# EAGLE design 7seg-weather (EAGLE 7.4.0)
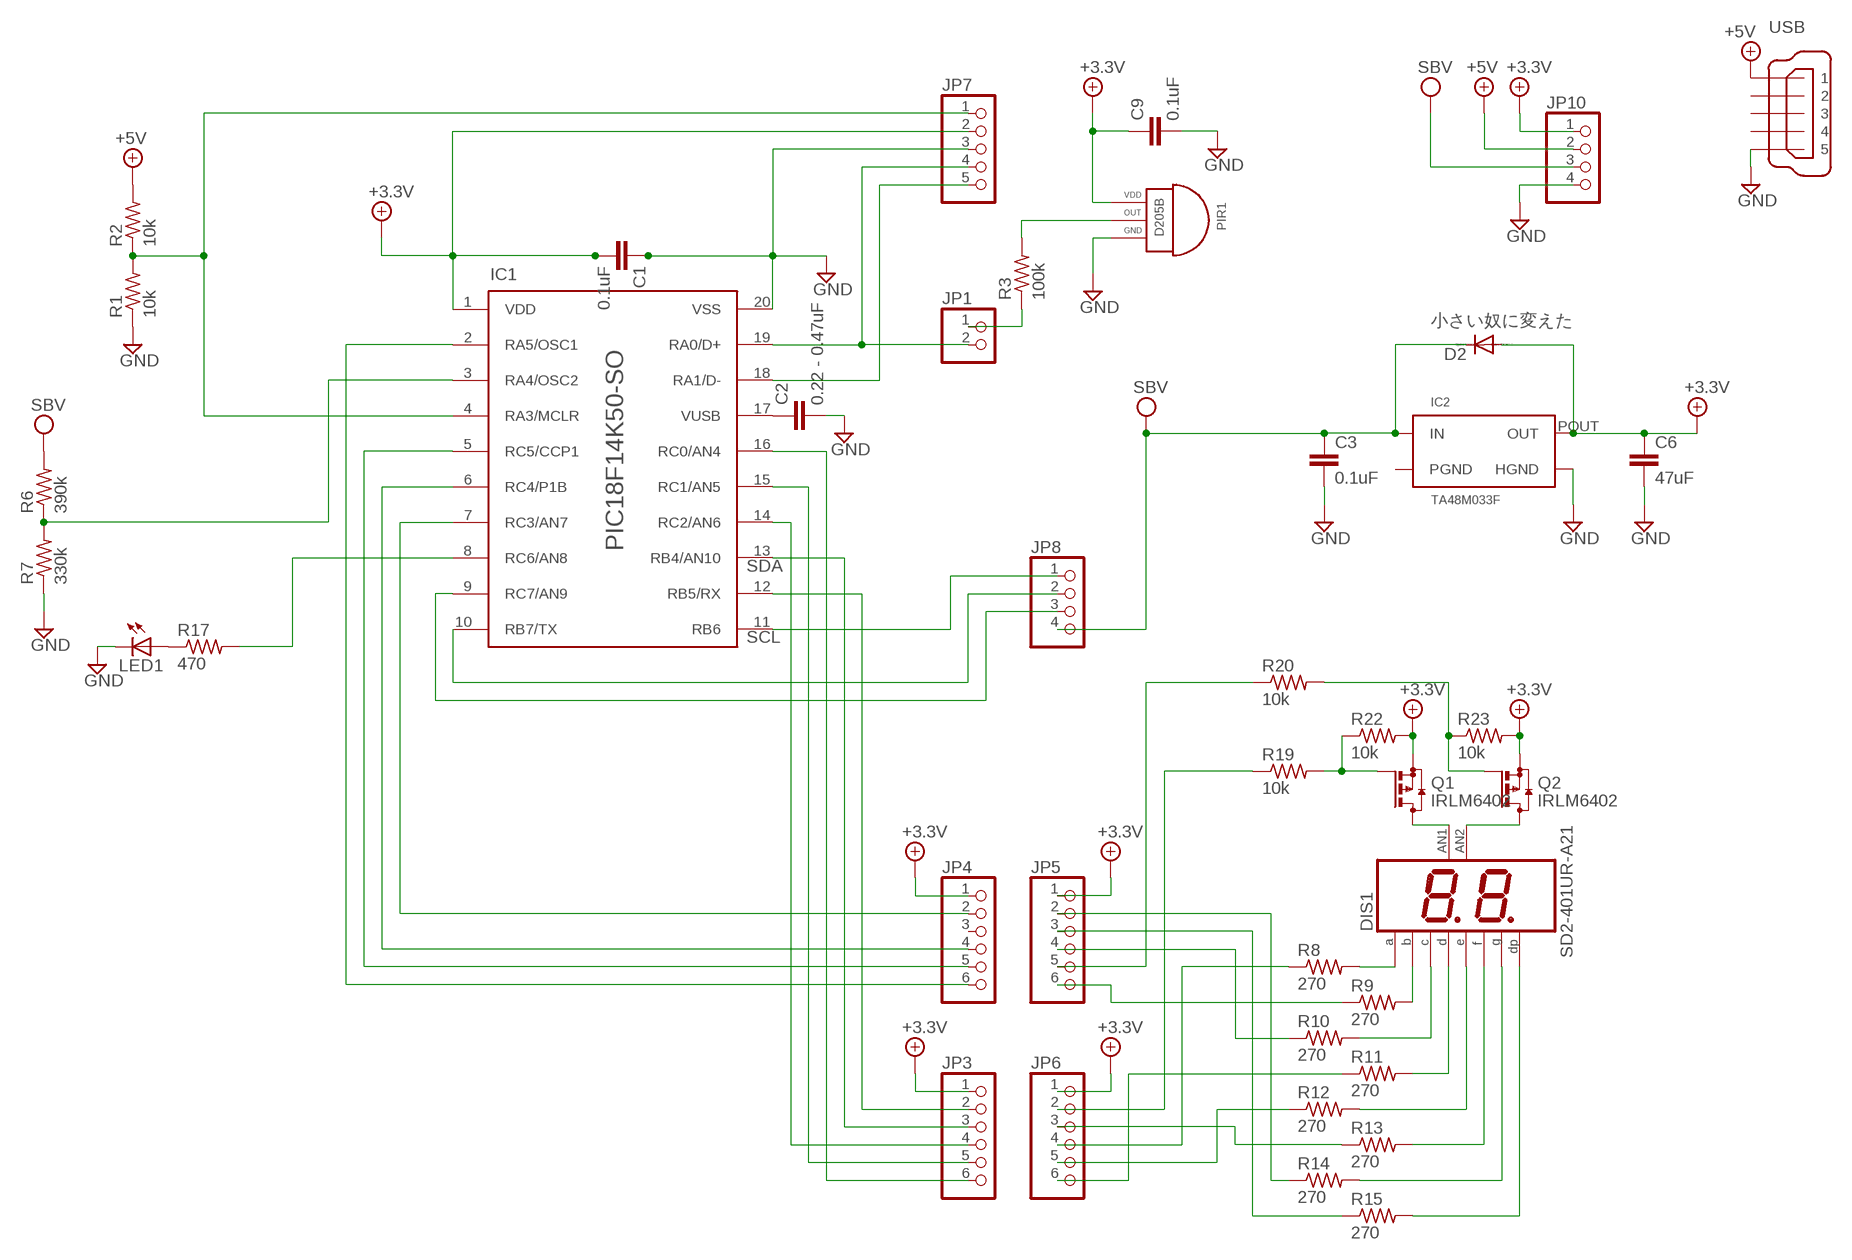
[diagram p0: schematic, sheet 1]

## Parts
C1  0.1uF  C-EUC0603K  [C0603K]
C2  0.22 - 0.47uF  C-EUC0603K  [C0603K]
C3  0.1uF  C-EUC0603K  [C0603K]
C6  47uF  C-EUC0603K  [C0603K]
C9  0.1uF  C-EUC0603K  [C0603K]
D2  DIODE-MELF-MLL41  [MELF-MLL41]
DIS1  SD2-401UR-A21  [SD2-401UR-A21]
IC1  PIC18F14K50-SO  [SO20]
IC2  TA48M033F  [HSOP3]
JP1  PINHD-1X2  [1X02]
JP3  PINHD-1X6  [1X06]
JP4  PINHD-1X6  [1X06]
JP5  PINHD-1X6  [1X06]
JP6  PINHD-1X6  [1X06]
JP7  PINHD-1X5  [1X05]
JP8  PINHD-1X4  [1X04]
JP10  PINHD-1X4  [1X04]
LED1  LG_T679-E1F1-1  [PLCC2]
PIR1  D205B  [3PIN]
Q1  IRLM6402  BSS84  [SOT23]
Q2  IRLM6402  BSS84  [SOT23]
R1  10k  R-US_M0805  [M0805]
R2  10k  R-US_M0805  [M0805]
R3  100k  R-US_M0805  [M0805]
R6  390k  R-US_M0805  [M0805]
R7  330k  R-US_M0805  [M0805]
R8  270  R-US_M0805  [M0805]
R9  270  R-US_M0805  [M0805]
R10  270  R-US_M0805  [M0805]
R11  270  R-US_M0805  [M0805]
R12  270  R-US_M0805  [M0805]
R13  270  R-US_M0805  [M0805]
R14  270  R-US_M0805  [M0805]
R15  270  R-US_M0805  [M0805]
R17  470  R-US_M0805  [M0805]
R19  10k  R-US_M0805  [M0805]
R20  10k  R-US_M0805  [M0805]
R22  10k  R-US_M0805  [M0805]
R23  10k  R-US_M0805  [M0805]
USB  MICRO-USB-ZX62R-B-5P  [ZX62R-B-5P]

## Nets
+3.3V: C1.2 C6.1 C9.1 D2.A IC1.1(VDD) IC2.POUT(OUT) JP3.1 JP4.1 JP5.1 JP6.1 JP7.2 JP10.1 PIR1.1(VDD) Q1.2(S) Q2.2(S) R22.2 R23.2
+5V/2: JP10.2 R2.2 USB.1 ; supply symbol labelled +5V
GND: C1.1 C2.2 C3.2 C6.2 C9.2 IC1.20(VSS) IC2.HGND JP7.3 JP10.4 LED1.C PIR1.3(GND) R1.1 R7.1 USB.5
N$1: IC1.18(RA1/D-) JP7.5
N$2: IC1.13(RB4/AN10) JP3.3
N$3: LED1.A R17.1
N$4: JP1.1 R3.1
N$6: PIR1.2(OUT) R3.2
N$7: IC1.3(RA4/OSC2) R6.1 R7.2
N$8: IC1.4(RA3/MCLR) JP7.1 R1.2 R2.1
N$9: C2.1 IC1.17(VUSB)
N$10: IC1.9(RC7/AN9) JP8.3
N$11: IC1.8(RC6/AN8) R17.2
N$12: IC1.12(RB5/RX) JP3.2
N$13: DIS1.P$5 Q1.3(D)
N$15: IC1.6(RC4/P1B) JP4.4
N$16: IC1.10(RB7/TX) JP8.2
N$17: IC1.14(RC2/AN6) JP3.4
N$18: DIS1.P$10 Q2.3(D)
N$22: IC1.2(RA5/OSC1) JP4.6
N$24: Q2.1(G) R20.2 R23.1
N$25: DIS1.P$3 R8.2
N$26: DIS1.P$9 R9.2
N$27: DIS1.P$8 R10.2
N$28: DIS1.P$6 R11.2
N$29: DIS1.P$7 R12.2
N$33: DIS1.P$4 R13.2
N$34: DIS1.P$1 R14.2
N$35: IC1.7(RC3/AN7) JP4.2
N$36: IC1.15(RC1/AN5) JP3.5
N$37: IC1.16(RC0/AN4) JP3.6
N$39: IC1.5(RC5/CCP1) JP4.5
N$40: Q1.1(G) R19.2 R22.1
N$41: DIS1.P$2 R15.2
N$42: IC1.11(RB6) JP8.1
N$43: IC1.19(RA0/D+) JP1.2 JP7.4
N$44: JP5.3 R15.1
N$45: JP6.4 R8.1
N$46: JP6.5 R12.1
N$47: JP6.6 R11.1
N$48: JP6.3 R13.1
N$50: JP5.4 R10.1
N$51: JP5.5 R20.1
N$52: JP6.2 R19.1
N$53: JP5.6 R9.1
N$54: JP5.2 R14.1
VPP: C3.1 D2.C IC2.PIN(IN) JP8.4 JP10.3 R6.2 ; supply symbol labelled SBV
Unconnected: JP4.3 USB.2 USB.3 USB.4

## Notes on the sheet
- 小さい奴に変えた
- SDA
- SCL

## Power pins joined to a net without a drawn wire
PGND: IC2.PGND

## Library data of the parts
C1-C3 C6 C9 = rcl:C-EU: CAPACITOR, European symbol
D2 = diode:DIODE-: DIODE
DIS1 = aitendo-SD2-401UR-A21:SD2-401UR-A21: 7 segment LED - SD2-401UR-A21 by aitendo http://aitendo3.sakura.ne.jp/aitendo_data/product_img/LED/7SEG/SD2-401UR-A21/SD2-401UR-A21_rev.03.pdf http://www.aitendo.com/product/11415
IC1 = pic18f14k50:PIC18F14K50-SO: 20-Lead Plastic Shrink Small Outline (SO) - Wide, 7.50mm Body [SOIC] Source: http://ww1.microchip.com/downloads/en/DeviceDoc/40001350F.pdf Souce: http://ww1.microchip.com/downloads/jp/DeviceDoc/41350D_JP.pdf (Japanese)
IC2 = toshiba-ta48mXXX:TA48M033F
JP1 = pinhead:PINHD-1X2: PIN HEADER
JP3-JP6 = pinhead:PINHD-1X6: PIN HEADER
JP7 = pinhead:PINHD-1X5: PIN HEADER
JP8 JP10 = pinhead:PINHD-1X4: PIN HEADER
LED1 = led:*_T679-?-1: LC TOPLED® Low Current LED Source: http://catalog.osram-os.com .. LG_LS_LY_T679_OBS.pdf; COLOR: green
PIR1 = senba-pir-sensor:D205B
Q1 Q2 = transistor-small-signal:BSS84: P-CHANNEL MOS FET
R1-R3 R6-R8 R10-R15 R17 R19 R20 R22 R23 = rcl:R-US_: RESISTOR, American symbol
R9 = resistor:R-US_: RESISTOR, American symbol
USB = con-hirose:MICRO-USB-: Hirose Micro USB Connector ZX62R-B-5P: Micro B, reverse (top mount) shell SMT Supplier: DigiKey H11574CT-ND Source: http://www.hirose.co.jp/cataloge_hp/e24200011.pdf

## Board
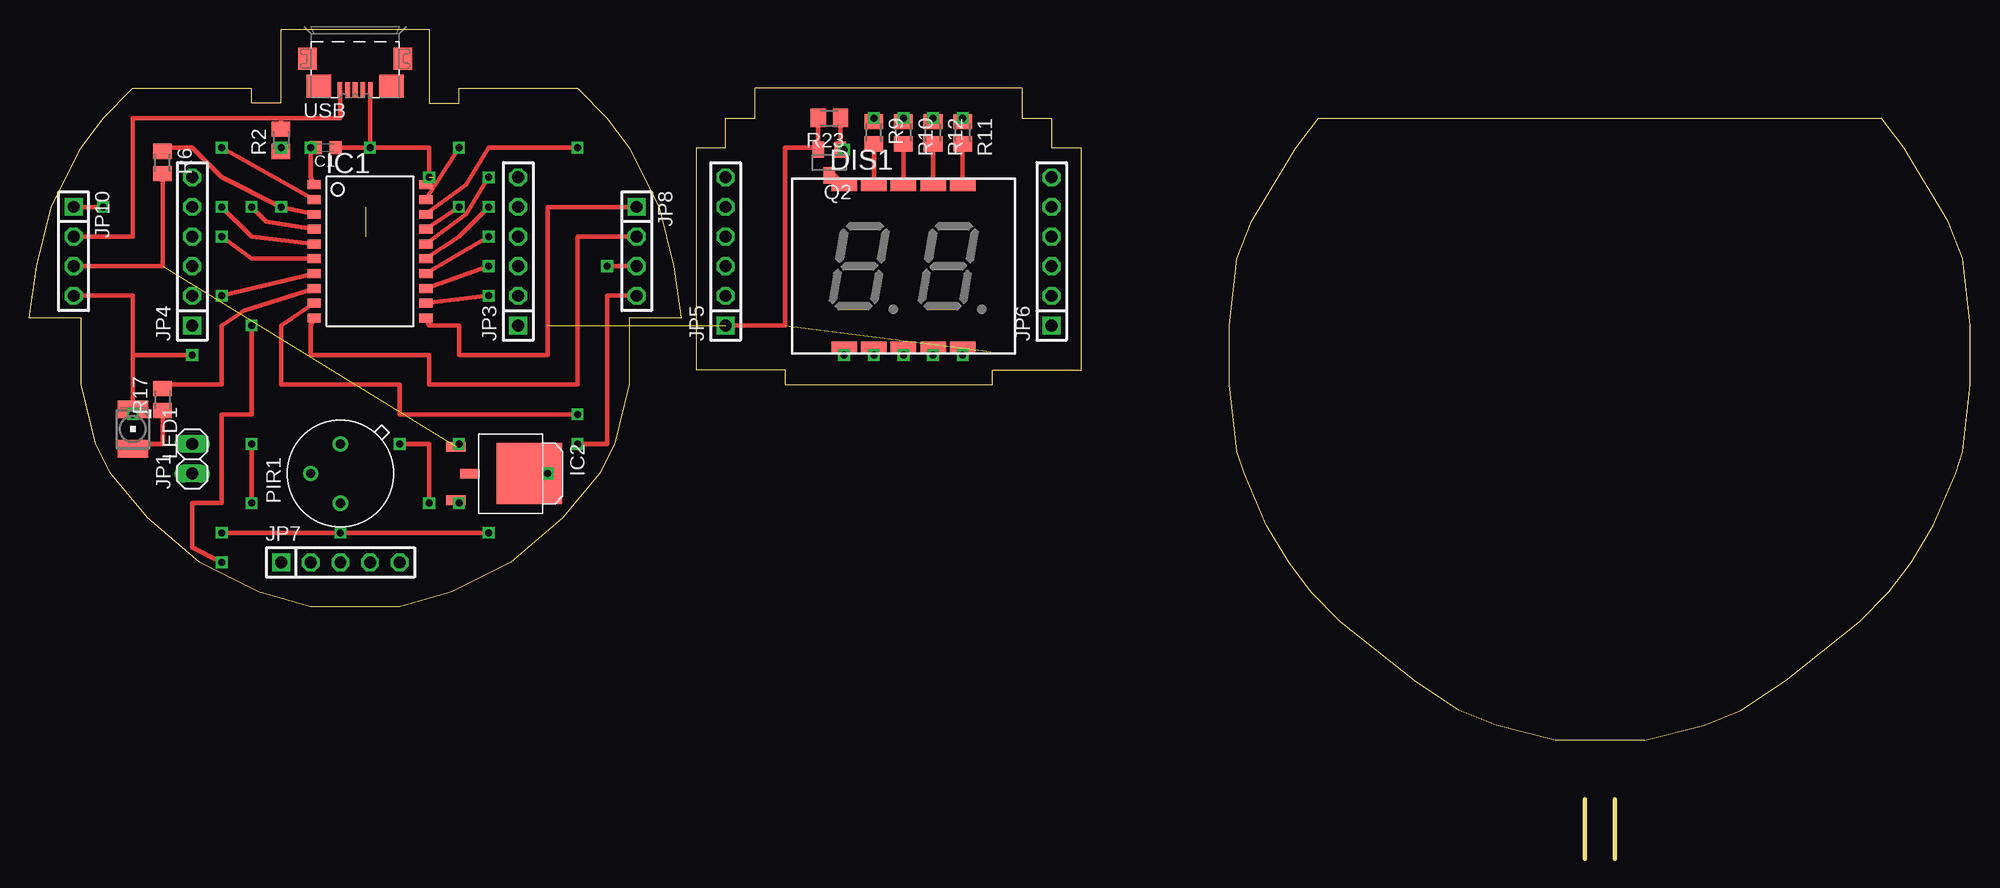
[diagram p1: board, top side]
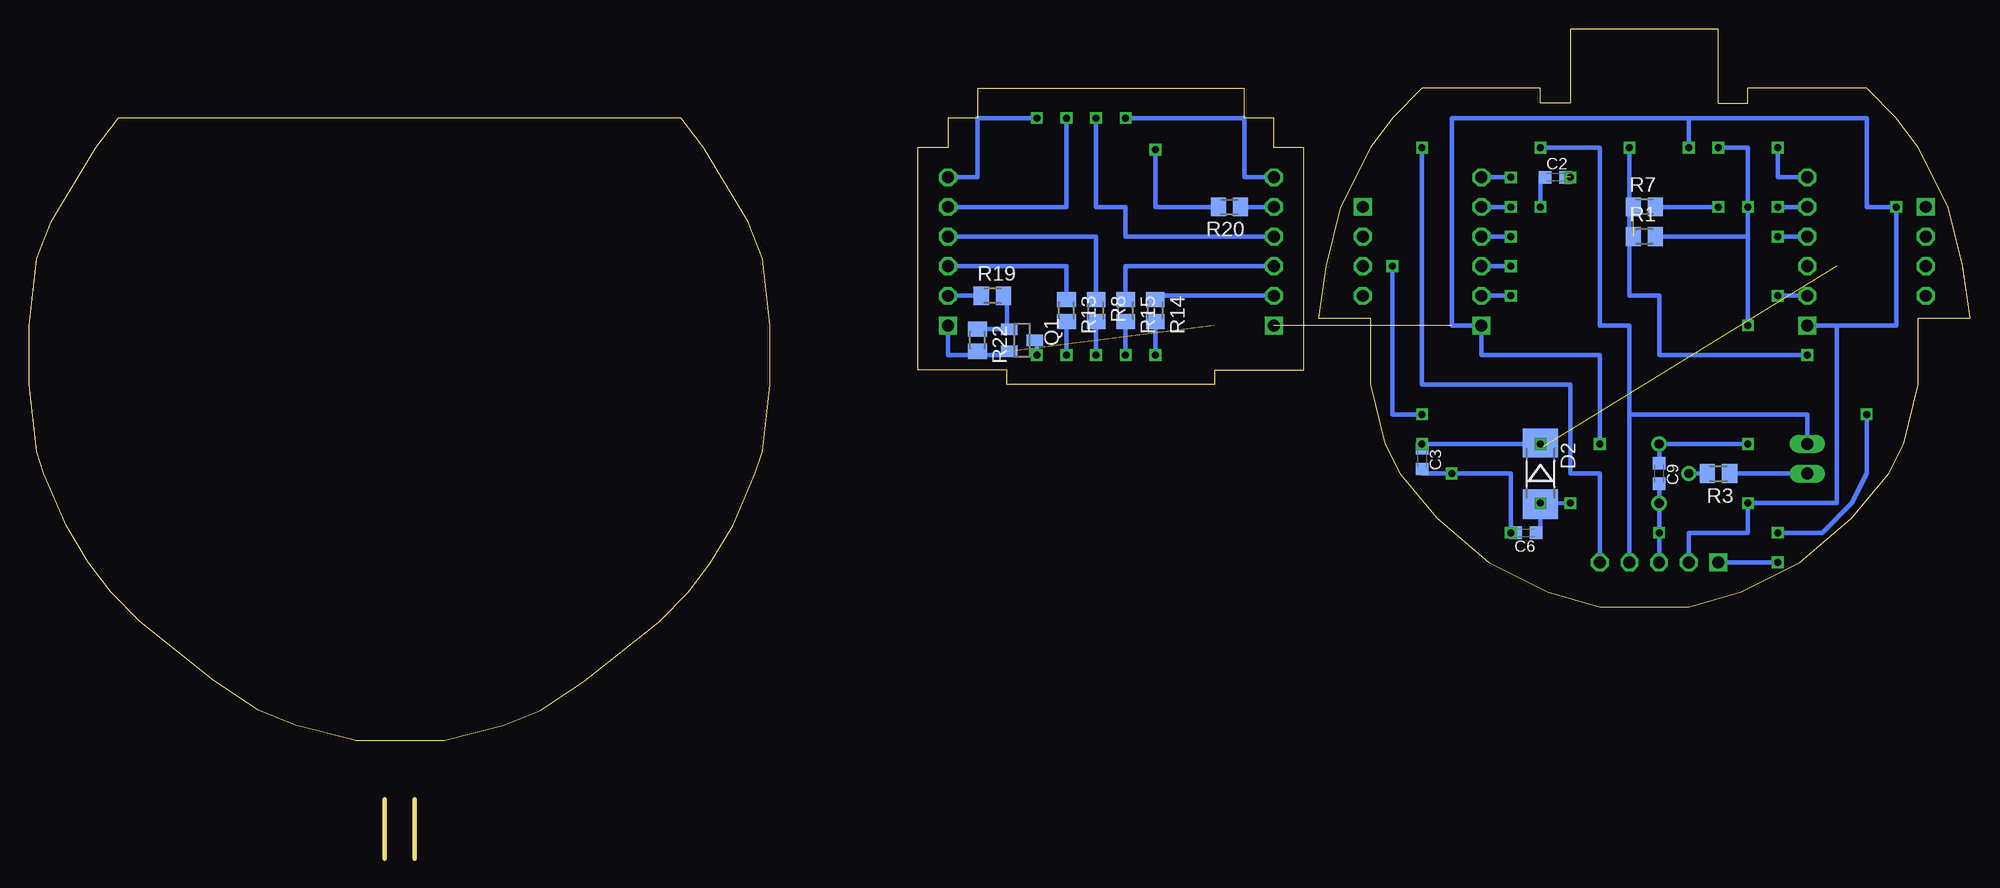
[diagram p2: board, bottom side, seen from below]

Size 166.37 x 71.12 mm. Coordinates in mm from the lower left corner, seen from the top.
Outline: 135.89,5.08 135.89,0
Outline: 133.35,5.08 133.35,0
Outline: 64.77,40.64 82.55,40.64 82.55,41.91 90.17,41.91 90.17,60.96 87.63,60.96 87.63,63.5 85.09,63.5 85.09,66.04 62.23,66.04 62.23,63.5 59.69,63.5 59.69,60.96 57.15,60.96 57.15,41.91 64.77,41.91 64.77,40.64
Outline: 138.43,10.16 143.51,11.43 146.69,12.7 150.5,15.24 156.84,20.32 159.39,22.86 161.29,25.4 163.19,28.57 165.1,33.02 165.74,34.93 166.37,40.64 166.37,45.72 165.74,51.44 164.47,54.61 160.66,60.96 158.75,63.5 110.49,63.5 108.59,60.96 104.78,54.61 103.51,51.44 102.87,45.72 102.87,40.64 103.51,34.93 104.14,33.02 106.05,28.57 107.95,25.4 109.86,22.86 112.4,20.32 118.75,15.24 122.56,12.7 125.73,11.43 130.81,10.16 138.43,10.16
Outline: 21.59,64.77 21.59,71.12 34.29,71.12 34.29,64.77 36.83,64.77 36.83,66.04 46.99,66.04 49.53,63.5 51.43,60.96 53.98,55.88 55.24,50.8 55.88,46.36 51.43,46.36 51.43,40.64 50.16,35.56 48.89,33.02 45.72,29.21 41.27,25.4 36.2,22.86 31.75,21.59 24.13,21.59 19.69,22.86 14.6,25.4 10.16,29.21 6.99,33.02 5.71,35.56 4.45,40.64 4.45,46.36 0,46.36 0.64,50.8 1.91,55.88 4.45,60.96 6.35,63.5 8.89,66.04 19.05,66.04 19.05,64.77 21.59,64.77
Copper layers (1*16): Top 0.035mm / dielectric 1.5mm / Bottom 0.035mm
Design rules "default": minimum track width 10mil, minimum drill 24mil, track to track 8mil, track to pad 8mil, pad to pad 8mil, via to via 8mil, smd to smd 8mil, copper to edge 40mil, drill to drill 8mil, minimum pad ring 10mil, minimum via ring 8mil, stop-mask expansion 4mil, vias tented up to drill 0mil, thermal gap 10mil

### Footprints (pad centres in the part's own frame; a part is rotated, then mirrored left to right if it is on the bottom)
C0603K = smd 1.05 x 1.08: 1 -0.875,0; 2 0.875,0
MELF-MLL41 = smd 2.5 x 3: A 2.625,0; C -2.625,0
SD2-401UR-A21 = smd 2.184 x 1.067: P$1 -5.08,-6.985; P$2 -2.54,-6.985; P$3 0,-6.985; P$4 2.54,-6.985; P$5 5.08,-6.985; P$6 5.08,6.985; P$7 2.54,6.985; P$8 0,6.985; P$9 -2.54,6.985; P$10 -5.08,6.985
SO20 = smd 0.762 x 1.143: 1 -5.08,-4.788; 2 -3.81,-4.788; 3 -2.54,-4.788; 4 -1.27,-4.788; 5 0,-4.788; 6 1.27,-4.788; 7 2.54,-4.788; 8 3.81,-4.788; 9 5.08,-4.788; 10 6.35,-4.788; 11 6.35,4.788; 12 5.08,4.788; 13 3.81,4.788; 14 2.54,4.788; 15 1.27,4.788; 16 0,4.788; 17 -1.27,4.788; 18 -2.54,4.788; 19 -3.81,4.788; 20 -5.08,4.788
HSOP3 = smd 5.2 x 5.588: HGND 0,1.587 | smd 0.813 x 1.676: PGND 0,-3.493; PIN -2.3,-4.7; POUT 2.3,-4.7
1X02 = drill 1.016 long: 1 -1.27,0; 2 1.27,0
1X06 = drill 1.016 square: 1 -6.35,0 | drill 1.016 octagon: 2 -3.81,0; 3 -1.27,0; 4 1.27,0; 5 3.81,0; 6 6.35,0
1X05 = drill 1.016 square: 1 -5.08,0 | drill 1.016 octagon: 2 -2.54,0; 3 0,0; 4 2.54,0; 5 5.08,0
1X04 = drill 1.016 square: 1 -3.81,0 | drill 1.016 octagon: 2 -1.27,0; 3 1.27,0; 4 3.81,0
PLCC2 = smd 2.6 x 1.5: A 0,1.7; C 0,-1.7
3PIN = drill 0.8: 1 2.54,0; 2 0,2.54; 3 -2.54,0
SOT23 = smd 1 x 1.4: 1 -0.95,-1.1; 2 0.95,-1.1; 3 0,1.1
M0805 = smd 1.3 x 1.6: 1 -0.95,0; 2 0.95,0
ZX62R-B-5P = smd 1.35 x 0.4: 1 2.675,-1.3; 2 2.675,-0.65; 3 2.675,0; 4 2.675,0.65; 5 2.675,1.3 | smd 1.9 x 1.6: M1 0,-4.1; M2 0,4.1 | smd 2 x 2.1: M3 2.35,3.1; M4 2.35,-3.1

### Placement (x,y rotation side)
C1  25.4,60.96 180 top
C2  35.56,58.42 0 bottom
C3  46.99,34.29 270 bottom
C6  38.1,27.94 180 bottom
C9  26.67,33.02 270 bottom
D2  36.83,33.02 270 bottom
DIS1  74.93,50.8 0 top
IC1  29.21,52.71 270 top
IC2  41.27,33.02 270 top
JP1  13.97,34.29 90 top
JP3  41.91,52.07 90 top
JP4  13.97,52.07 90 top
JP5  59.69,52.07 90 top
JP6  87.63,52.07 90 top
JP7  26.67,25.4 0 top
JP8  52.07,52.07 270 top
JP10  3.81,52.07 270 top
LED1  8.89,36.83 180 top
PIR1  26.67,33.02 90 top
Q1  81.28,44.45 270 bottom
Q2  68.58,59.69 180 top
R1  27.94,53.34 0 bottom
R2  21.59,61.6 90 top
R3  21.59,33.02 180 bottom
R6  11.43,59.69 270 top
R7  27.94,55.88 0 bottom
R8  74.93,46.99 270 bottom
R9  72.39,62.23 270 top
R10  74.93,62.23 270 top
R11  80.01,62.23 270 top
R12  77.47,62.23 270 top
R13  77.47,46.99 270 bottom
R14  69.85,46.99 270 bottom
R15  72.39,46.99 270 bottom
R17  11.43,39.37 90 top
R19  83.82,48.26 0 bottom
R20  63.5,55.88 180 bottom
R22  85.09,44.45 270 bottom
R23  68.58,63.5 180 top
USB  27.94,68.58 270 top

### Tracks (layer width: path | path; a pad name or v marks a point on that pad's centre or on a via)
+3.3V  (via drill 0.6)  (2 unrouted)
  Top 0.406: R23.2 Q2.2 67.63,60.96 64.77,60.96 64.77,45.72 JP5.1 | IC1.1 24.13,58.42 v24.13,60.96 C1.2 | v6.35,55.88 JP10.1 | v31.75,35.56 34.29,35.56 v34.29,30.48 | v36.83,30.48 IC2.POUT | v19.05,35.56 v19.05,30.48
  Bottom 0.406: Q1.2 82.55,43.5 82.55,43.18 85.09,43.18 | R22.2 85.09,43.18 | 85.09,43.18 87.63,43.18 JP6.1 | v24.13,60.96 24.13,63.5 | 24.13,63.5 8.89,63.5 8.89,55.88 v6.35,55.88 6.35,45.72 11.43,45.72 | JP4.1 11.43,45.72 | 24.13,63.5 44.45,63.5 44.45,45.72 JP3.1 41.91,43.18 31.75,43.18 v31.75,35.56 | JP7.2 24.13,27.94 19.05,27.94 v19.05,30.48 11.43,30.48 11.43,45.72 | C9.1 PIR1.1 v19.05,35.56 | v34.29,30.48 D2.A | C6.1 36.83,27.94 D2.A | D2.A v36.83,30.48
+5V/2
  Top 0.406: USB.1 26.67,65.91 26.67,63.5 21.59,63.5 | 21.59,63.5 8.89,63.5 8.89,53.34 JP10.2 | R2.2 21.59,63.5
GND  (via drill 0.6)  (2 unrouted)
  Top 0.406: USB.5 29.21,65.91 v29.21,60.96 | C1.1 v29.21,60.96 | IC1.20 v34.29,58.42 34.29,60.96 v29.21,60.96 | v8.89,38.1 8.89,48.26 JP10.4 | v8.89,38.1 8.89,43.18 v13.97,43.18 | v44.45,33.02 IC2.HGND | LED1.C v8.89,38.1 | v39.37,27.94 v26.67,27.94 v16.51,27.94
  Bottom 0.406: v13.97,43.18 26.67,43.18 26.67,48.26 29.21,48.26 29.21,55.88 | 29.21,55.88 v29.21,60.96 | R7.1 29.21,55.88 | R1.1 29.21,53.34 | C9.2 PIR1.3 v26.67,27.94 JP7.3 | C6.2 v39.37,27.94 39.37,33.02 v44.45,33.02 46.99,33.02 C3.2 | v16.51,27.94 12.7,27.94 10.16,30.48 8.89,33.02 v8.89,38.1
N$1  (via drill 0.6)
  Top 0.406: IC1.18 37.46,57.79 39.37,60.96 v46.99,60.96
  Bottom 0.406: v46.99,60.96 46.99,40.64 34.29,40.64 34.29,33.02 31.75,33.02 JP7.5
N$2  (via drill 0.6)
  Top 0.406: IC1.13 v39.37,50.8
  Bottom 0.406: v39.37,50.8 JP3.3
N$3
  Top 0.406: LED1.A 8.89,35.56 11.43,35.56 R17.1
N$4
  Bottom 0.406: JP1.1 R3.1
N$6
  Bottom 0.406: R3.2 PIR1.2
N$7  (via drill 0.6)
  Top 0.406: IC1.3 v21.59,55.88 16.51,58.42 13.97,60.96 11.43,60.96 R6.1
  Bottom 0.406: R7.2 v21.59,55.88
N$8  (via drill 0.6)
  Top 0.406: IC1.4 20.32,54.61 v19.05,55.88 | R2.1 v21.59,60.96 | v19.05,45.72 19.05,38.1 16.51,38.1 16.51,30.48 13.97,30.48 13.97,26.67 v16.51,25.4
  Bottom 0.406: v19.05,55.88 19.05,60.96 v21.59,60.96 | R1.2 19.05,53.34 v19.05,55.88 | v19.05,55.88 v19.05,45.72 | v16.51,25.4 JP7.1
N$9  (via drill 0.6)
  Top 0.406: IC1.17 v36.83,55.88
  Bottom 0.406: C2.1 36.83,58.42 v36.83,55.88
N$10  (via drill 0.6)
  Top 0.406: IC1.9 21.59,45.72 21.59,40.64 31.75,40.64 31.75,38.1 v46.99,38.1 | v49.53,50.8 JP8.3
  Bottom 0.406: v46.99,38.1 49.53,38.1 v49.53,50.8
N$11
  Top 0.406: IC1.8 18.41,46.99 16.51,45.72 16.51,40.64 11.43,40.64 R17.2
N$12  (via drill 0.6)
  Top 0.406: IC1.12 v39.37,48.26
  Bottom 0.406: v39.37,48.26 JP3.2
N$13  (via drill 0.6)
  Top 0.406: DIS1.P$5 v80.01,43.18
  Bottom 0.406: Q1.3 80.01,44.45 v80.01,43.18
N$15  (via drill 0.6)
  Top 0.406: v16.51,53.34 19.05,51.44 IC1.6
  Bottom 0.406: v16.51,53.34 JP4.4
N$16
  Top 0.406: IC1.10 24.13,45.72 24.13,43.18 34.29,43.18 34.29,40.64 46.99,40.64 46.99,53.34 JP8.2
N$17  (via drill 0.6)
  Top 0.406: IC1.14 v39.37,53.34
  Bottom 0.406: v39.37,53.34 JP3.4
N$18
  Top 0.406: Q2.3 69.05,58.59 DIS1.P$10
N$22  (via drill 0.6)
  Top 0.406: IC1.2 v16.51,60.96
  Bottom 0.406: JP4.6 16.51,58.42 v16.51,60.96
N$24  (via drill 0.6)
  Top 0.406: R23.1 Q2.1 v69.85,60.79 69.85,60.96
  Bottom 0.406: R20.2 69.85,55.88 v69.85,60.79
N$25  (via drill 0.6)
  Top 0.406: DIS1.P$3 v74.93,43.18
  Bottom 0.406: v74.93,43.18 R8.2
N$26
  Top 0.406: DIS1.P$9 R9.2
N$27
  Top 0.406: DIS1.P$8 R10.2
N$28
  Top 0.406: DIS1.P$6 R11.2
N$29
  Top 0.406: DIS1.P$7 R12.2
N$33  (via drill 0.6)
  Top 0.406: DIS1.P$4 v77.47,43.18
  Bottom 0.406: v77.47,43.18 R13.2
N$34  (via drill 0.6)
  Top 0.406: DIS1.P$1 v69.85,43.18
  Bottom 0.406: v69.85,43.18 R14.2
N$35  (via drill 0.6)
  Top 0.406: IC1.7 v16.51,48.26
  Bottom 0.406: v16.51,48.26 JP4.2
N$36  (via drill 0.6)
  Top 0.406: IC1.15 36.83,53.34 v39.37,55.88
  Bottom 0.406: v39.37,55.88 JP3.5
N$37  (via drill 0.6)
  Top 0.406: IC1.16 37.46,55.25 v39.37,58.42
  Bottom 0.406: v39.37,58.42 JP3.6
N$39  (via drill 0.6)
  Top 0.406: v16.51,55.88 19.05,53.34 IC1.5
  Bottom 0.406: JP4.5 v16.51,55.88
N$40
  Bottom 0.406: R22.1 Q1.1 82.55,45.4 82.55,48.26 R19.2
N$41  (via drill 0.6)
  Top 0.406: DIS1.P$2 v72.39,43.18
  Bottom 0.406: v72.39,43.18 R15.2
N$42
  Top 0.406: IC1.11 34.29,45.72 36.83,45.72 36.83,43.18 44.45,43.18 44.45,55.88 JP8.1
N$43  (via drill 0.6)
  Top 0.406: IC1.19 v36.83,60.96
  Bottom 0.406: JP7.4 29.21,38.1 | 29.21,38.1 29.21,45.72 31.75,45.72 31.75,60.96 v36.83,60.96 | JP1.2 13.97,38.1 29.21,38.1
N$44
  Bottom 0.406: JP5.3 72.39,50.8 R15.1
N$45
  Bottom 0.406: R8.1 74.93,53.34 JP6.4
N$46  (via drill 0.6)
  Top 0.406: R12.1 v77.47,63.5
  Bottom 0.406: JP6.5 77.47,55.88 v77.47,63.5
N$47  (via drill 0.6)
  Top 0.406: R11.1 v80.01,63.5
  Bottom 0.406: v80.01,63.5 85.09,63.5 85.09,58.42 JP6.6
N$48
  Bottom 0.406: JP6.3 77.47,50.8 R13.1
N$50  (via drill 0.6)
  Top 0.406: v74.93,63.5 R10.1
  Bottom 0.406: v74.93,63.5 74.93,55.88 72.39,55.88 72.39,53.34 JP5.4
N$51
  Bottom 0.406: JP5.5 R20.1
N$52
  Bottom 0.406: R19.1 JP6.2
N$53  (via drill 0.6)
  Top 0.406: v72.39,63.5 R9.1
  Bottom 0.406: JP5.6 62.23,58.42 62.23,63.5 v72.39,63.5
N$54
  Bottom 0.406: JP5.2 69.85,48.26 R14.1
VPP  (via drill 0.6)  (1 unrouted)
  Top 0.406: R6.2 11.43,50.8 JP10.3 | JP8.4 49.53,48.26 49.53,35.56 v46.99,35.56 | v36.83,35.56 IC2.PIN
  Bottom 0.406: D2.C v36.83,35.56 v46.99,35.56 C3.1